# Altium schematic sheet [3]-MCU.SchDoc
size A3
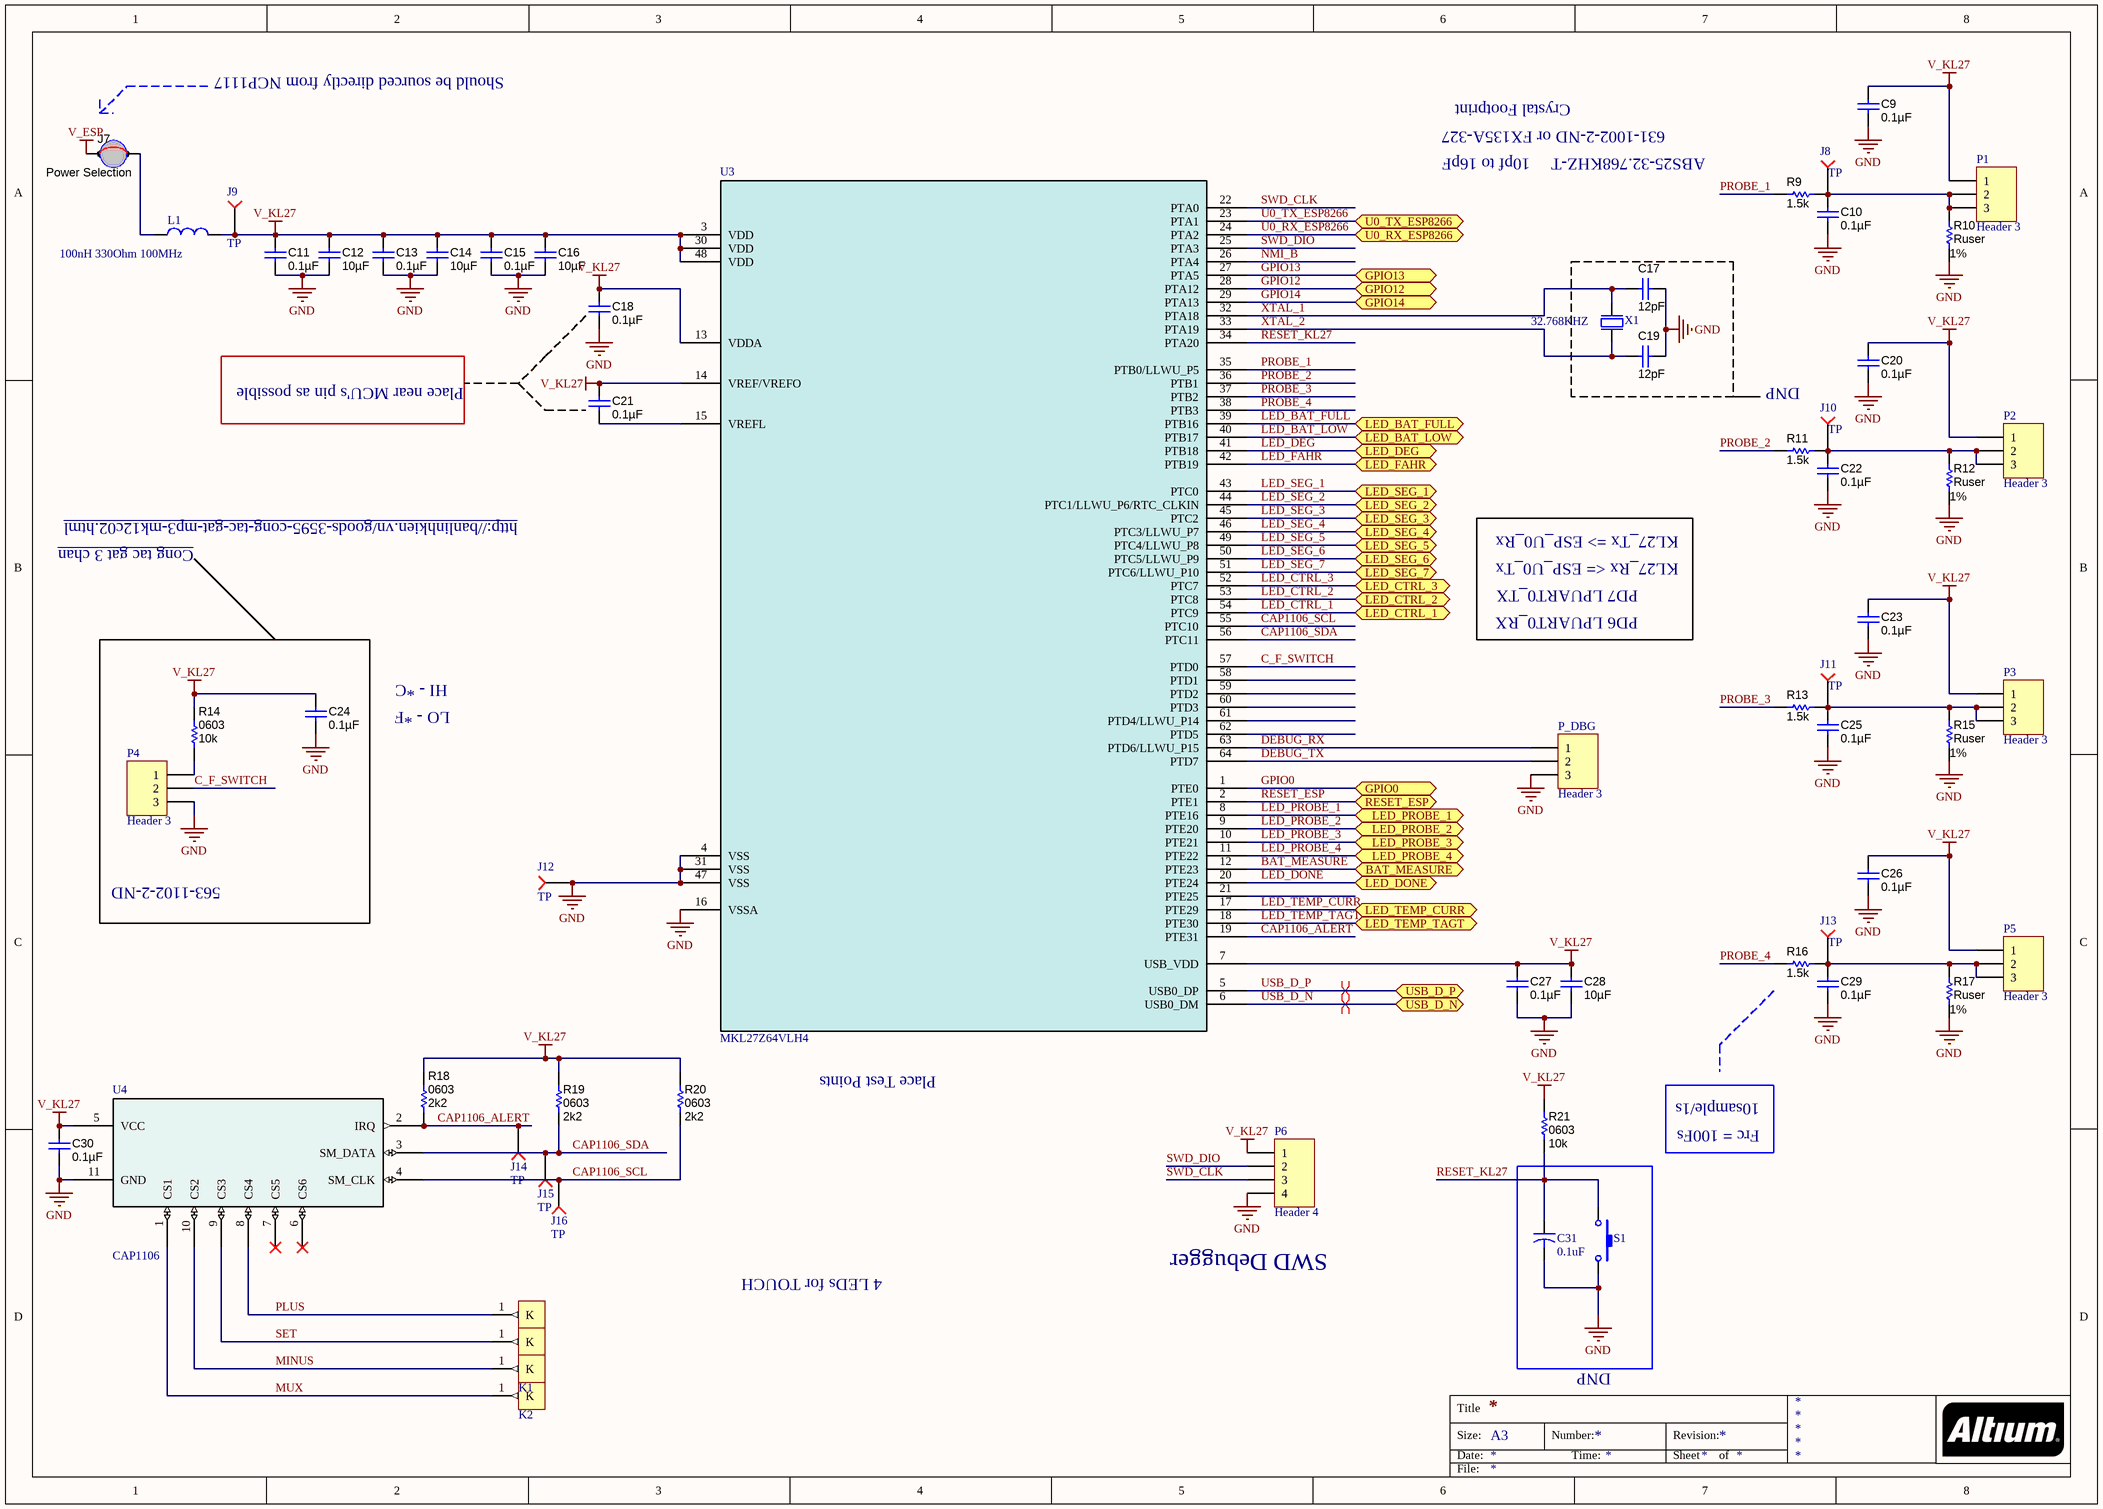
[diagram p0: [3]-MCU.SchDoc]

## Parts
C9  ValueDisplayed: 0.1µF  [0603]  (hidden comment: 0603YC104JAT2A)
C10  ValueDisplayed: 0.1µF  [0603]  (hidden comment: 0603YC104JAT2A)
C11  ValueDisplayed: 0.1µF  [0603]  (hidden comment: 0603YC104JAT2A)
C12  ValueDisplayed: 10µF  [0603]  (hidden comment: 0603YC104JAT2A)
C13  ValueDisplayed: 0.1µF  [0603]  (hidden comment: 0603YC104JAT2A)
C14  ValueDisplayed: 10µF  [0603]  (hidden comment: 0603YC104JAT2A)
C15  ValueDisplayed: 0.1µF  [0603]  (hidden comment: 0603YC104JAT2A)
C16  ValueDisplayed: 10µF  [0603]  (hidden comment: 0603YC104JAT2A)
C17  ValueDisplayed: 12pF  [0603]  (hidden comment: 0603YC104JAT2A)
C18  ValueDisplayed: 0.1µF  [0603]  (hidden comment: 0603YC104JAT2A)
C19  ValueDisplayed: 12pF  [0603]  (hidden comment: 0603YC104JAT2A)
C20  ValueDisplayed: 0.1µF  [0603]  (hidden comment: 0603YC104JAT2A)
C21  ValueDisplayed: 0.1µF  [0603]  (hidden comment: 0603YC104JAT2A)
C22  ValueDisplayed: 0.1µF  [0603]  (hidden comment: 0603YC104JAT2A)
C23  ValueDisplayed: 0.1µF  [0603]  (hidden comment: 0603YC104JAT2A)
C24  ValueDisplayed: 0.1µF  [0603]  (hidden comment: 0603YC104JAT2A)
C25  ValueDisplayed: 0.1µF  [0603]  (hidden comment: 0603YC104JAT2A)
C26  ValueDisplayed: 0.1µF  [0603]  (hidden comment: 0603YC104JAT2A)
C27  ValueDisplayed: 0.1µF  [0603]  (hidden comment: 0603YC104JAT2A)
C28  ValueDisplayed: 10µF  [0603]  (hidden comment: 0603YC104JAT2A)
C29  ValueDisplayed: 0.1µF  [0603]  (hidden comment: 0603YC104JAT2A)
C30  ValueDisplayed: 0.1µF  [0603]  (hidden comment: 0603YC104JAT2A)
C31  0.1uF  [0603]
J7  Power Selection  [HDR1X2]
J8  TP  [TP]
J9  TP  [TP]
J10  TP  [TP]
J11  TP  [TP]
J12  TP  [TP]
J13  TP  [TP]
J14  TP  [TP]
J15  TP  [TP]
J16  TP  [TP]
K1  Single_Key  [PAD_FINGETIP]  (value not drawn)
K2  Single_Key  [PAD_FINGETIP]  (value not drawn)
K3  Single_Key  [PAD_FINGETIP]  (value not drawn)
K4  Single_Key  [PAD_FINGETIP]  (value not drawn)
L1  100nH 330Ohm 100MHz  [0805]
P1  Header 3  [JACK_MONO]
P2  Header 3  [JACK_MONO]
P3  Header 3  [JACK_MONO]
P4  Header 3  [SW_Slide]
P5  Header 3  [JACK_MONO]
P6  Header 4  [hdR1x4]
P_DBG  Header 3  [HDR1X3]
R9  value 1.5k  [0603]  (hidden comment: CRCW06031K00FKEA)
R10  value Ruser  Value1: 1%  [0603]  (hidden comment: CRCW06031K00FKEA)
R11  value 1.5k  [0603]  (hidden comment: CRCW06031K00FKEA)
R12  value Ruser  Value1: 1%  [0603]  (hidden comment: CRCW06031K00FKEA)
R13  value 1.5k  [0603]  (hidden comment: CRCW06031K00FKEA)
R14  value 10k  [0603]  (hidden comment: CRCW08051K00JNEA)
R15  value Ruser  Value1: 1%  [0603]  (hidden comment: CRCW06031K00FKEA)
R16  value 1.5k  [0603]  (hidden comment: CRCW06031K00FKEA)
R17  value Ruser  Value1: 1%  [0603]  (hidden comment: CRCW06031K00FKEA)
R18  value 2k2  [0603]  (hidden comment: CRCW08051K00JNEA)
R19  value 2k2  [0603]  (hidden comment: CRCW08051K00JNEA)
R20  value 2k2  [0603]  (hidden comment: CRCW08051K00JNEA)
R21  value 10k  [0603]  (hidden comment: CRCW08051K00JNEA)
S1  SW-SMD  [SW-SMD]  (value not drawn)
U3  MKL27Z64VLH4  [98ASS23234W]
U4  CAP1106  [TDFN33-10pin]
X1  32.768KHZ  [XTAL_3215]

## Blocks framed on the sheet
563-1102-2-ND: C24 P4 R14
DNP: C31 S1

## Ports
BAT_MEASURE (bidir), GPIO0 (bidir), GPIO12 (bidir), GPIO13 (bidir), GPIO14 (bidir), LED_BAT_FULL (bidir), LED_BAT_LOW (bidir), LED_CTRL_1 (bidir), LED_CTRL_2 (bidir), LED_CTRL_3 (bidir), LED_DEG (bidir), LED_DONE (bidir), LED_FAHR (bidir), LED_PROBE_1 (bidir), LED_PROBE_2 (bidir), LED_PROBE_3 (bidir), LED_PROBE_4 (bidir), LED_SEG_1 (bidir), LED_SEG_2 (bidir), LED_SEG_3 (bidir), LED_SEG_4 (bidir), LED_SEG_5 (bidir), LED_SEG_6 (bidir), LED_SEG_7 (bidir), LED_TEMP_CURR (bidir), LED_TEMP_TAGT (bidir), RESET_ESP (bidir), U0_RX_ESP8266 (bidir), U0_TX_ESP8266 (bidir), USB_D_N (bidir), USB_D_P (bidir)

## Nets
GND: C9.2 C10.2 C11.2 C12.2 C13.2 C14.2 C15.2 C16.2 C17.2 C18.2 C19.2 C20.2 C22.2 C23.2 C24.2 C25.2 C26.2 C27.2 C28.2 C29.2 C30.2 C31.2 J12.0 P4.3 P6.4 P_DBG.3 R10.1 R12.1 R15.1 R17.1 S1.2 U3.4(VSS) U3.16(VSSA) U3.31(VSS) U3.47(VSS) U4.11(GND)
V_ESP: J7.1
V_KL27: C9.1 C11.1 C12.1 C13.1 C14.1 C15.1 C16.1 C18.1 C20.1 C21.1 C23.1 C24.1 C26.1 C27.1 C28.1 C30.1 J9.0 L1.2 P1.1 P2.1 P3.1 P5.1 P6.1 R14.1 R18.1 R19.1 R20.1 R21.1 U3.3(VDD) U3.7(USB_VDD) U3.13(VDDA) U3.14(VREF/VREFO) U3.30(VDD) U3.48(VDD) U4.5(VCC)
BAT_MEASURE: U3.12(PTE23) ; port BAT_MEASURE
C_F_SWITCH: P4.2 U3.57(PTD0)
CAP1106_ALERT: J14.0 R18.2 U3.19(PTE31) U4.2(IRQ)
CAP1106_SCL: J16.0 R20.2 U3.55(PTC10) U4.4(SM_CLK)
CAP1106_SDA: J15.0 R19.2 U3.56(PTC11) U4.3(SM_DATA)
DEBUG_RX: P_DBG.1 U3.63(PTD6/LLWU_P15)
DEBUG_TX: P_DBG.2 U3.64(PTD7)
GPIO0: U3.1(PTE0) ; port GPIO0
GPIO12: U3.28(PTA12) ; port GPIO12
GPIO13: U3.27(PTA5) ; port GPIO13
GPIO14: U3.29(PTA13) ; port GPIO14
LED_BAT_FULL: U3.39(PTB16) ; port LED_BAT_FULL
LED_BAT_LOW: U3.40(PTB17) ; port LED_BAT_LOW
LED_CTRL_1: U3.54(PTC9) ; port LED_CTRL_1
LED_CTRL_2: U3.53(PTC8) ; port LED_CTRL_2
LED_CTRL_3: U3.52(PTC7) ; port LED_CTRL_3
LED_DEG: U3.41(PTB18) ; port LED_DEG
LED_DONE: U3.20(PTE24) ; port LED_DONE
LED_FAHR: U3.42(PTB19) ; port LED_FAHR
LED_PROBE_1: U3.8(PTE16) ; port LED_PROBE_1
LED_PROBE_2: U3.9(PTE20) ; port LED_PROBE_2
LED_PROBE_3: U3.10(PTE21) ; port LED_PROBE_3
LED_PROBE_4: U3.11(PTE22) ; port LED_PROBE_4
LED_SEG_1: U3.43(PTC0) ; port LED_SEG_1
LED_SEG_2: U3.44(PTC1/LLWU_P6/RTC_CLKIN) ; port LED_SEG_2
LED_SEG_3: U3.45(PTC2) ; port LED_SEG_3
LED_SEG_4: U3.46(PTC3/LLWU_P7) ; port LED_SEG_4
LED_SEG_5: U3.49(PTC4/LLWU_P8) ; port LED_SEG_5
LED_SEG_6: U3.50(PTC5/LLWU_P9) ; port LED_SEG_6
LED_SEG_7: U3.51(PTC6/LLWU_P10) ; port LED_SEG_7
LED_TEMP_CURR: U3.17(PTE29) ; port LED_TEMP_CURR
LED_TEMP_TAGT: U3.18(PTE30) ; port LED_TEMP_TAGT
MINUS: K1.1(K) U4.10(CS2)
MUX: K2.1(K) U4.1(CS1)
NMI_B: U3.26(PTA4)
PLUS: K4.1(K) U4.8(CS4)
PROBE_1: R9.2 U3.35(PTB0/LLWU_P5)
PROBE_2: R11.2 U3.36(PTB1)
PROBE_3: R13.2 U3.37(PTB2)
PROBE_4: R16.2 U3.38(PTB3)
RESET_ESP: U3.2(PTE1) ; port RESET_ESP
RESET_KL27: C31.1 R21.2 S1.1 U3.34(PTA20)
SET: K3.1(K) U4.9(CS3)
SWD_CLK: P6.3 U3.22(PTA0)
SWD_DIO: P6.2 U3.25(PTA3)
U0_RX_ESP8266: U3.24(PTA2) ; port U0_RX_ESP8266
U0_TX_ESP8266: U3.23(PTA1) ; port U0_TX_ESP8266
USB_D_N: U3.6(USB0_DM) ; port USB_D_N
USB_D_P: U3.5(USB0_DP) ; port USB_D_P
XTAL_1: C17.1 U3.32(PTA18) X1.2(out)
XTAL_2: C19.1 U3.33(PTA19) X1.1(inp)
NetC10_1: C10.1 J8.0 P1.2 P1.3 R9.1 R10.2
NetC21_2: C21.2 U3.15(VREFL)
NetC22_1: C22.1 J10.0 P2.2 P2.3 R11.1 R12.2
NetC25_1: C25.1 J11.0 P3.2 P3.3 R13.1 R15.2
NetC29_1: C29.1 J13.0 P5.2 P5.3 R16.1 R17.2
NetJ7_2: J7.2 L1.1
NetP4_1: P4.1 R14.2

Not connected (* = marked no-connect by the designer): U3 21(PTE25) 58(PTD1) 59(PTD2) 60(PTD3) 61(PTD4/LLWU_P14) 62(PTD5); U4 6(CS6)* 7(CS5)*

## Layout directives
differential pair: USB_D_N, USB_D_P

## Notes on the sheet
- Should be sourced directly from NCP1117
- Crystal Footprint
- 10pf to 16pF
- 631-1002-2-ND or FX135A-327
- ABS25-32.768KHZ-T
- Place near MCU's pin as possible
- DNP
- http://banlinhkien.vn/goods-3595-cong-tac-gat-mp3-mk12c02.html
- Cong tac gat 3 chan
- PD7 LPUART0_TX
- KL27_Tx => ESP_U0_Rx
- KL27_Rx <= ESP_U0_Tx
- PD6 LPUART0_RX
- HI - *C
- LO - *F
- Place Test Points
- 10sample/1s
- Frc = 100Fs
- SWD Debugger
- 4 LEDs for TOUCH
- Title
- Size:
- Date:
- A3
- Number:
- Time:
- Revision:
- Sheet
- of
- File:

## Library data of the parts
C9-C30 = Cap_0603: CAP, CERM, 0.1uF, 16V, +/-5%, X7R, 0603; Manufacturer: AVX; Polarized: N; CompType: Capacitor; U/M: EA; Cap_F: 0.0000001; Tolerance_%: 5; ESR_Ohm: 0.039; Value1: 0.039 ohm; VDC_V: 16; TaMin_C: -55; TaMax_C: 125; SymbolVersion: 2008-07-09; Value: 0.1uF; PartNumber: 0603YC104JAT2A; PackageReference: 0603; RoHS: Y; Value2: 16V; MountType: SMT; Technology: Ceramic; TempCo: X7R; Cap_Case: 0603; Published: 2008-06-19; Publisher: Texas Instruments; LatestRevisionDate: 2012-08-23; LatestRevisionNote: Changed publisher; ComponentLink1Description: Datasheet link; ComponentLink1URL: http://www.avx.com/docs/masterpubs/smccp.pdf; Alternate PartNumber: -; Alternate Manufacturer: -; Supplier 1: Digi-Key; Supplier Part Number 1: 478-3726-1-ND; Supplier 2: Farnell; Supplier Part Number 2: 1396198; Supplier 3: Arrow; Supplier Part Number 3: 0603YC104JAT2A
C31 = Cap 0805: Ceramic; Published: 8-Jun-2000; LatestRevisionDate: 17-Jul-2002; LatestRevisionNote: Re-released for DXP Platform.; PackageReference: POLAR0.8; Publisher: Altium Limited
J7 = 923345-02-C: Jumper Wire, 200mil spacing, Red, pkg of 200; Manufacturer: 3M; Alternate Manufacturer: Any; Alternate PartNumber: Equivalent; SymbolCreator: a0412235; U/M: EA; SymbolVersion: 2010-08-18; PartNumber: 923345-02-C; CompType: Jumper Wire; RoHS: Y; PackageReference: 200 mil Jumper Wire; MountType: TH; ComponentLink1Description: Datasheet Link; ComponentLink1URL: http://multimedia.3m.com/mws/mediawebserver?66666UuZjcFSLXTtNX&c5x&6EVuQEcuZgVs6EVs6E666666--; Publisher: Texas Instruments; LatestRevisionDate: 2012-11-04; LatestRevisionNote: Added parts, moved some to Hardware.IntLib; Supplier 1: Digi-Key; Supplier Part Number 1: 923345-02-ND; Supplier 2: Mouser; Supplier Part Number 2: 517-923345-02; Supplier 3: Newark; Supplier Part Number 3: 19M8560
J8-J16 = TP: Test point (true); .Sch checked: OK; .PCB  checked: OK
K1-K4 = Single_Key: Single Key Touch; Sharpe: Round/Square; Name: Single Touch Key; Created by: TuongPV
L1 = L1: Inductor; Value: 150 mH
P1-P5 P_DBG = Header 3: Header, 3-Pin; LatestRevisionDate: 17-Jul-2002; LatestRevisionNote: Re-released for DXP Platform.; Publisher: Altium Limited
P6 = Header 4: Header, 4-Pin; LatestRevisionDate: 17-Jul-2002; LatestRevisionNote: Re-released for DXP Platform.; Publisher: Altium Limited
R9-R13 R15-R17 = R0603: RES, 1.00k ohm, 1%, 0.1W, 0603; Manufacturer: Vishay-Dale; Alternate Manufacturer: Any; Alternate PartNumber: Equivalent; CompType: Resistor; Res_ohm: 1000; Value_Code: 1k00; Tolerance_%: 1; Power_W: 0.1; VDC_V: 75; TempCo: 100 ppm/C; EIA_Code: E96; U/M: EA; SymbolVersion: 2009-05-29; PartNumber: CRCW06031K00FKEA; PackageReference: 0603; RoHS: Y; Value2: 0.1W; MountType: SMT; Technology: Thick Film; Published: 2008-06-26; Publisher: Texas Instruments; LatestRevisionDate: 2012-10-04; LatestRevisionNote: Changed publisher; ComponentLink1Description: Datasheet link; ComponentLink1URL: http://www.vishay.com/docs/20035/dcrcwe3.pdf; Supplier 1: Digi-Key; Supplier Part Number 1: 541-1.00KHCT-ND; Supplier 2: Farnell; Supplier Part Number 2: 1151593; Supplier 3: Newark; Supplier Part Number 3: 52K8015
  R9 R11 R13 R16: Value1: 1%
R14 R18-R21 = R0805_025W: RES 5%, 0.125W, 0805; Manufacturer: Vishay-Dale; Alternate Manufacturer: Any; Alternate PartNumber: Equivalent; CompType: Resistor; Res_ohm: 1000; Value_Code: 1k00; Tolerance_%: 5; Power_W: 0.125; VDC_V: 150; TempCo: 200 ppm/C; EIA_Code: E24; U/M: EA; SymbolVersion: 2009-05-29; PartNumber: CRCW08051K00JNEA; PackageReference: 0805; RoHS: Y; Value1: 0603; Value2: 0.125W; MountType: SMT; Technology: Thick Film; Published: 2008-06-26; Publisher: Texas Instruments; LatestRevisionDate: 2012-10-04; LatestRevisionNote: Changed publisher; ComponentLink1Description: Datasheet link; ComponentLink1URL: http://www.vishay.com/docs/20035/dcrcwe3.pdf; Supplier 1: Digi-Key; Supplier Part Number 1: 541-1.0KACT-ND; Supplier 2: Farnell; Supplier Part Number 2: 1562615; Supplier 3: Newark; Supplier Part Number 3: 52K9725
S1 = SW-SMD: Switch; Published: 24-Mar-1999; LatestRevisionDate: 17-Jul-2002; LatestRevisionNote: Re-released for DXP Platform.; PackageReference: SPST-2; Publisher: Altium Limited
U3 = MKL27Z64VLH4: ARM cortex M0+ 64Kb Flash LQFP-64; Vendor: Freescale; Manufacturer_Part_Number: mkl27z64vlh4; RefDes: RefDes; Type: DEV; Value: Value; Footprint: LQFP-64
U4 = CAP1106: 6 Channel Capacitive Touch Sensor; Manufacturer: Microchip; CompType: IC; PIN_COUNT: 11; Application_BuildNumber: *; PartNumber: CAP1106; MountType: SMT; RoHS: Y
X1 = XTAL_SMD3215: XTAL SMD 3215, 32.768kHz, 9pF, ±20ppm; Part Number: XTAL_FC-135 32.768k; Manufacturer: Epson Toyocom; Manufacturer Part Number: FC-135 32.768KHZ ±20PPM,9.0PF; 2nd source part number: 127-8037; Note: XTAL SMD 32.768kHz, 3215; Artikkelnr Noca: 22019091; Artikkelnr Simpro: N.A.; Datasheet: http://www.farnell.com/datasheets/57480.pdf; LatestRevisionDate: 2014-03-27; Pin Count: 2; Publisher: Nordic Semiconductor; Published: 2010-10-18; Value: 32.768kHz; Supplier: Digi-Key; Supplier part number: FC-135 32.7680KA-AC-ND; 2nd source Supplier: Farnell; Footprint Doc: XTAL_3215